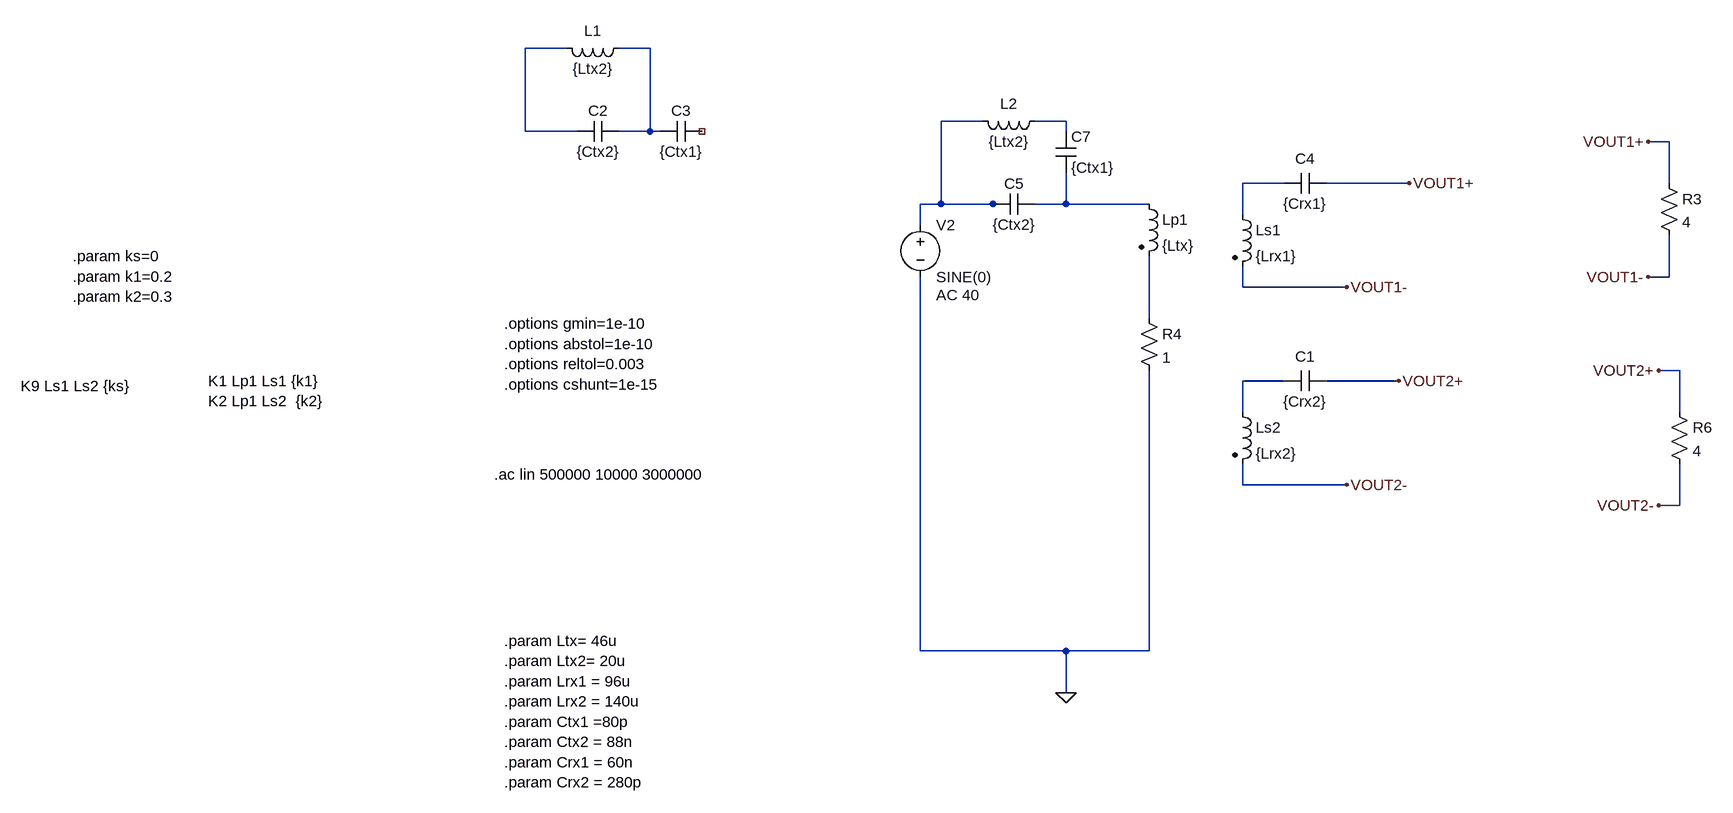
[diagram p0: schematic Design_wide_band.asc]
Design_wide_band.asc, the LTspice schematic file:
Version 4
SHEET 1 3864 3572
WIRE 304 400 240 400
WIRE 432 400 384 400
WIRE 944 512 880 512
WIRE 1072 512 1024 512
WIRE 240 528 240 400
WIRE 320 528 240 528
WIRE 432 528 432 400
WIRE 432 528 384 528
WIRE 448 528 432 528
WIRE 1072 528 1072 512
WIRE 2000 544 1968 544
WIRE 1408 608 1344 608
WIRE 1600 608 1472 608
WIRE 2000 608 2000 544
WIRE 880 640 880 512
WIRE 880 640 848 640
WIRE 960 640 880 640
WIRE 976 640 960 640
WIRE 1072 640 1072 592
WIRE 1072 640 1024 640
WIRE 1200 640 1072 640
WIRE 1344 656 1344 608
WIRE 848 672 848 640
WIRE 2000 752 2000 688
WIRE 2000 752 1968 752
WIRE 1344 768 1344 736
WIRE 1504 768 1344 768
WIRE 1200 816 1200 720
WIRE 2016 896 1984 896
WIRE 1408 912 1344 912
WIRE 1584 912 1472 912
WIRE 1344 960 1344 912
WIRE 2016 960 2016 896
WIRE 1344 1072 1344 1040
WIRE 1504 1072 1344 1072
WIRE 2016 1104 2016 1040
WIRE 2016 1104 1984 1104
WIRE 848 1328 848 752
WIRE 1072 1328 848 1328
WIRE 1200 1328 1200 896
WIRE 1200 1328 1072 1328
WIRE 1072 1392 1072 1328
FLAG 1984 896 VOUT2+
FLAG 1984 1104 VOUT2-
FLAG 1072 1392 0
FLAG 1968 544 VOUT1+
FLAG 1968 752 VOUT1-
FLAG 1600 608 VOUT1+
FLAG 1504 768 VOUT1-
FLAG 1584 912 VOUT2+
FLAG 1504 1072 VOUT2-
SYMBOL ind2 1184 624 R0
SYMATTR InstName Lp1
SYMATTR Value {Ltx}
SYMATTR Type ind
SYMBOL ind2 1328 640 R0
SYMATTR InstName Ls1
SYMATTR Value {Lrx1}
SYMATTR Type ind
SYMBOL cap 1472 592 R90
WINDOW 0 -6 32 VBottom 2
WINDOW 3 32 32 VTop 2
SYMATTR InstName C4
SYMATTR Value {Crx1}
SYMBOL ind2 1328 944 R0
SYMATTR InstName Ls2
SYMATTR Value {Lrx2}
SYMATTR Type ind
SYMBOL cap 1472 896 R90
WINDOW 0 -6 32 VBottom 2
WINDOW 3 32 32 VTop 2
SYMATTR InstName C1
SYMATTR Value {Crx2}
SYMBOL res 2000 944 R0
SYMATTR InstName R6
SYMATTR Value 4
SYMBOL voltage 848 656 R0
WINDOW 123 24 124 Left 2
WINDOW 39 0 0 Left 0
SYMATTR Value2 AC 40
SYMATTR InstName V2
SYMATTR Value SINE(0)
SYMBOL res 1984 592 R0
SYMATTR InstName R3
SYMATTR Value 4
SYMBOL res 1184 800 R0
SYMATTR InstName R4
SYMATTR Value 1
SYMBOL cap 384 512 R90
WINDOW 0 0 32 VBottom 2
WINDOW 3 32 32 VTop 2
SYMATTR InstName C2
SYMATTR Value {Ctx2}
SYMBOL ind 400 384 R90
WINDOW 0 5 56 VBottom 2
WINDOW 3 32 56 VTop 2
SYMATTR InstName L1
SYMATTR Value {Ltx2}
SYMBOL cap 512 512 R90
WINDOW 0 0 32 VBottom 2
WINDOW 3 32 32 VTop 2
SYMATTR InstName C3
SYMATTR Value {Ctx1}
SYMBOL cap 1024 624 R90
WINDOW 0 0 32 VBottom 2
WINDOW 3 32 32 VTop 2
SYMATTR InstName C5
SYMATTR Value {Ctx2}
SYMBOL ind 1040 496 R90
WINDOW 0 5 56 VBottom 2
WINDOW 3 32 56 VTop 2
SYMATTR InstName L2
SYMATTR Value {Ltx2}
SYMBOL cap 1056 528 R0
SYMATTR InstName C7
SYMATTR Value {Ctx1}
TEXT 208 1312 Left 2 !.param Ltx= 46u\n.param Ltx2= 20u\n.param Lrx1 = 96u\n.param Lrx2 = 140u\n.param Ctx1 =80p\n.param Ctx2 = 88n\n.param Crx1 = 60n\n.param Crx2 = 280p
TEXT 192 1056 Left 2 !.ac lin 500000 10000 3000000
TEXT 208 824 Left 2 !.options gmin=1e-10   \n.options abstol=1e-10  \n.options reltol=0.003  \n.options cshunt=1e-15
TEXT -248 912 Left 2 !K1 Lp1 Ls1 {k1}\nK2 Lp1 Ls2  {k2}
TEXT -536 920 Left 2 !K9 Ls1 Ls2 {ks}
TEXT -456 720 Left 2 !.param ks=0\n.param k1=0.2\n.param k2=0.3

The netlist it stands for:
* Design_wide_band.asc
Lp1 N006 N007 {Ltx}
Ls1 N005 VOUT1- {Lrx1}
C4 VOUT1+ N005 {Crx1}
Ls2 N008 VOUT2- {Lrx2}
C1 VOUT2+ N008 {Crx2}
R6 VOUT2+ VOUT2- 4
V2 N003 0 SINE(0) AC 40
R3 VOUT1+ VOUT1- 4
R4 N007 0 1
C2 N002 N001 {Ctx2}
L1 N002 N001 {Ltx2}
C3 NC_01 N002 {Ctx1}
C5 N006 N003 {Ctx2}
L2 N004 N003 {Ltx2}
C7 N004 N006 {Ctx1}
.param Ltx= 46u
.param Ltx2= 20u
.param Lrx1 = 96u
.param Lrx2 = 140u
.param Ctx1 =80p
.param Ctx2 = 88n
.param Crx1 = 60n
.param Crx2 = 280p
.ac lin 500000 10000 3000000
.options gmin=1e-10
.options abstol=1e-10
.options reltol=0.003
.options cshunt=1e-15
K1 Lp1 Ls1 {k1}
K2 Lp1 Ls2  {k2}
K9 Ls1 Ls2 {ks}
.param ks=0
.param k1=0.2
.param k2=0.3
.backanno
.end